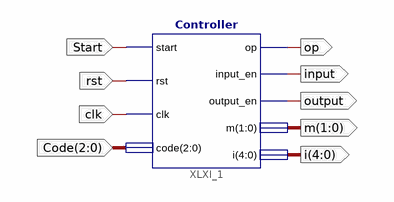
[diagram p0: schematic sheet 1]
// Xilinx ISE schematic Controller1.sch (spartan3e) as structural Verilog: 1 symbols, 9 ports
module Controller1 (
  input  Start,
  input  rst,
  input  clk,
  input  [2:0] Code,
  output op,
  output \input ,
  output \output ,
  output [1:0] m,
  output [4:0] i
);

  Controller XLXI_1 (
    .start(Start), .rst(rst), .clk(clk), .code(Code), .op(op), .input_en(\input ), .output_en(\output ),
    .m(m), .i(i));
endmodule
